# EAGLE design PlusCartUnified_X7 (EAGLE 7.7.0)
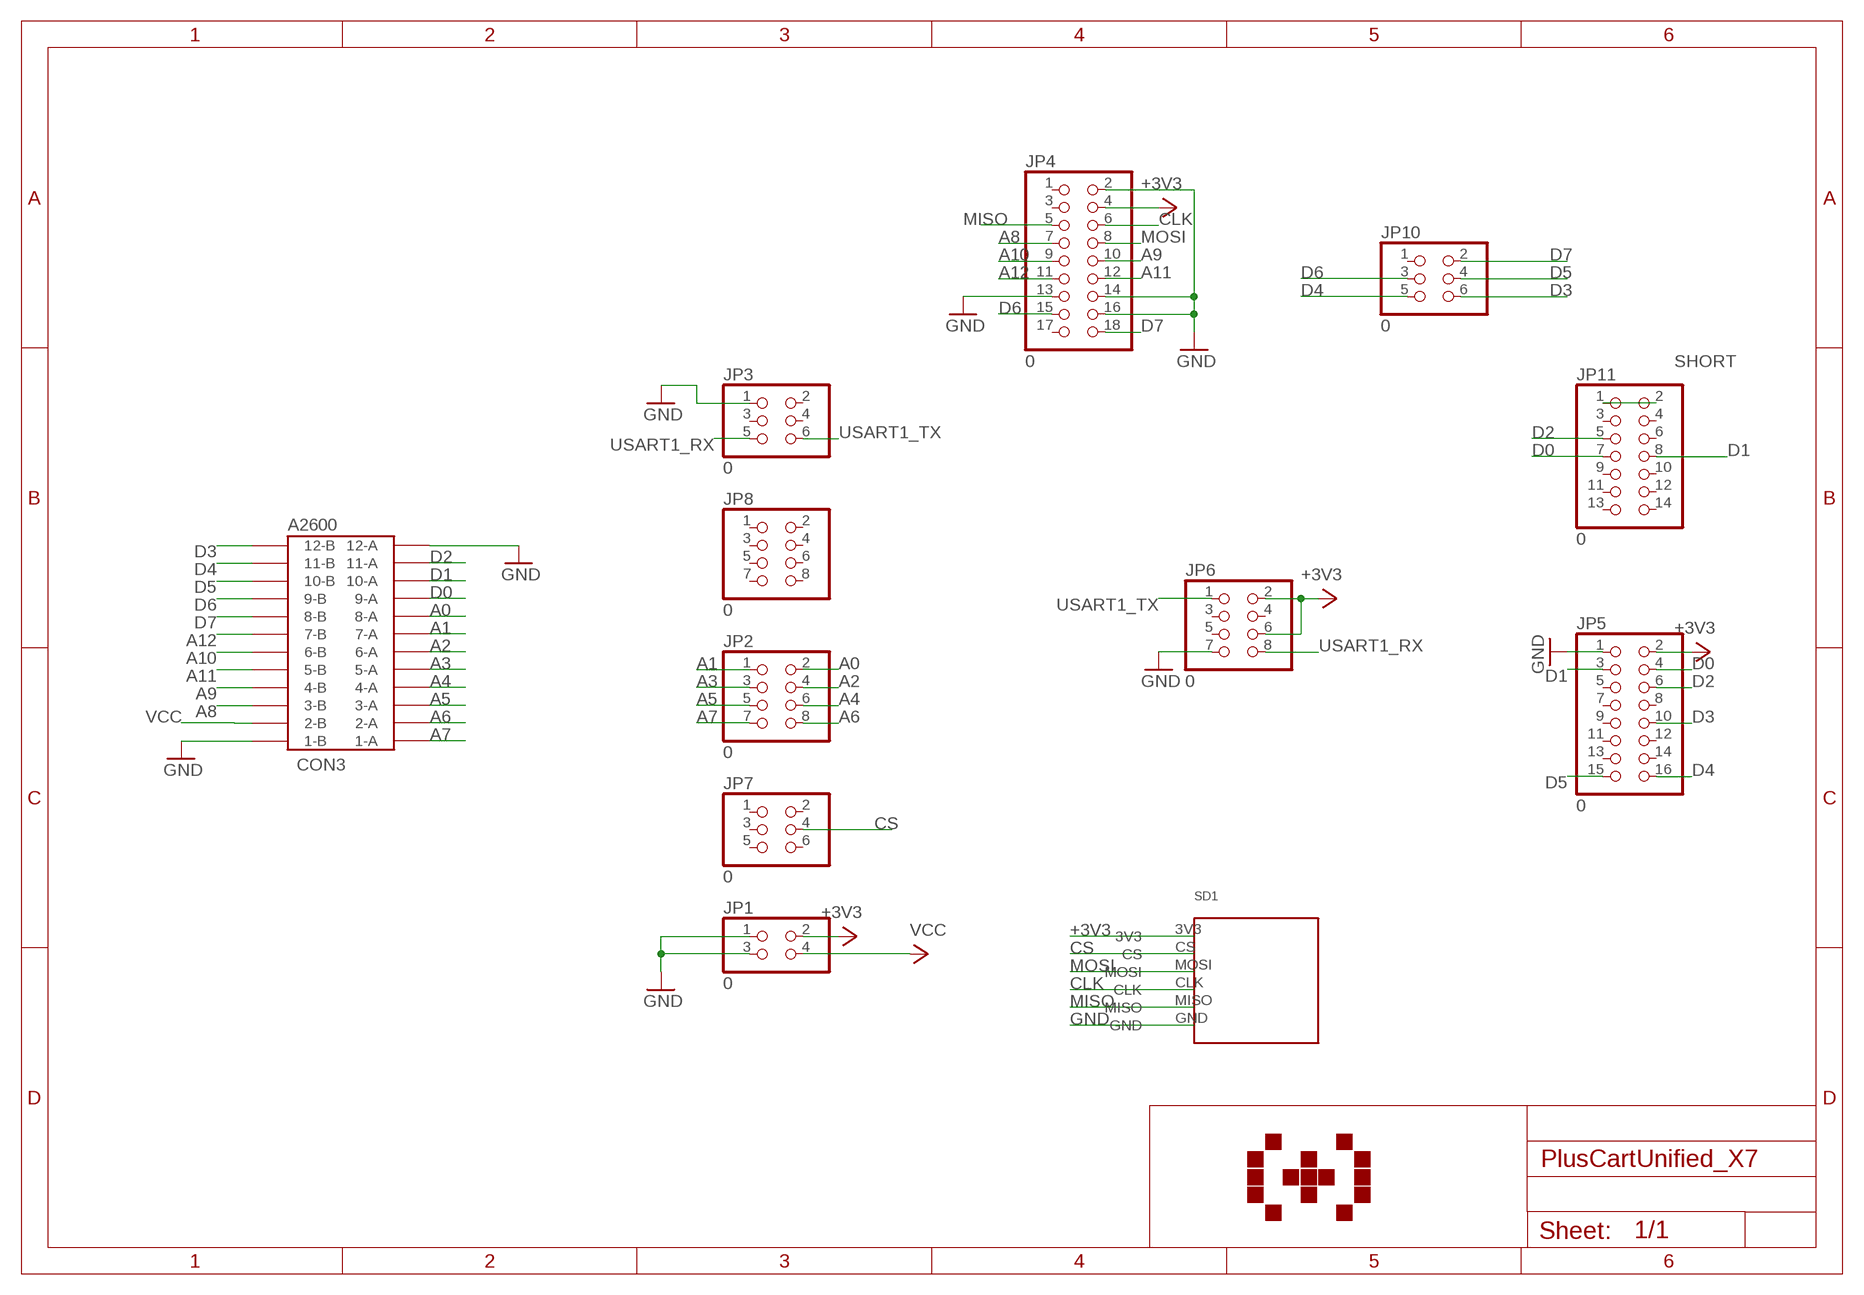
[diagram p0: schematic, sheet 1]

## Parts
CON3  A2600  24PINEDGE-254MM  [24PINEDGE-254MM]
JP1  0  PINHD-2X2  [2X02]
JP2  0  PINHD-2X4  [2X04]
JP3  0  PINHD-2X3  [2X03]
JP4  0  PINHD-2X9  [2X09]
JP5  0  PINHD-2X8  [2X08]
JP6  0  PINHD-2X4  [2X04]
JP7  0  PINHD-2X3  [2X03]
JP8  0  PINHD-2X4  [2X04]
JP10  0  PINHD-2X3  [2X03]
JP11  0  PINHD-2X7  [2X07]
SD1  MICROSDMICROSD2  [MICROSD_FOOTPRINT]

## Nets
+3V3: JP1.2 JP4.4 JP5.2 JP6.2 JP6.6 SD1.3V3
A0: CON3.8-A JP2.2
A1: CON3.7-A JP2.1
A2: CON3.6-A JP2.4
A3: CON3.5-A JP2.3
A4: CON3.4-A JP2.6
A5: CON3.3-A JP2.5
A6: CON3.2-A JP2.8
A7: CON3.1-A JP2.7
A8: CON3.3-B JP4.7
A9: CON3.4-B JP4.10
A10: CON3.6-B JP4.9
A11: CON3.5-B JP4.12
A12: CON3.7-B JP4.11
CLK: JP4.6 SD1.CLK
CS: JP7.4 SD1.CS
D0: CON3.9-A JP5.4 JP11.7
D1: CON3.10-A JP5.3 JP11.8
D2: CON3.11-A JP5.6 JP11.5
D3: CON3.12-B JP5.10 JP10.6
D4: CON3.11-B JP5.16 JP10.5
D5: CON3.10-B JP5.15 JP10.4
D6: CON3.9-B JP4.15 JP10.3
D7: CON3.8-B JP4.18 JP10.2
GND: CON3.1-B CON3.12-A JP1.1 JP1.3 JP3.1 JP4.2 JP4.13 JP4.14 JP4.16 JP5.1 JP6.7 SD1.GND
MISO: JP4.5 SD1.MISO
MOSI: JP4.8 SD1.MOSI
SHORT: JP11.1 JP11.2
USART1_RX: JP3.5 JP6.8
USART1_TX: JP3.6 JP6.1
VCC: CON3.2-B JP1.4
Unconnected: JP3.2 JP3.3 JP3.4 JP4.1 JP4.3 JP4.17 JP5.5 JP5.7 JP5.8 JP5.9 JP5.11 JP5.12 JP5.13 JP5.14 JP6.3 JP6.4 JP6.5 JP7.1 JP7.2 JP7.3 JP7.5 JP7.6 JP8.1 JP8.2 JP8.3 JP8.4 JP8.5 JP8.6 JP8.7 JP8.8 JP10.1 JP11.3 JP11.4 JP11.6 JP11.9 JP11.10 JP11.11 JP11.12 JP11.13 JP11.14

## Library data of the parts
CON3 = con-edge:24PINEDGE-254MM: 24 PIN EDGE CONNECTOR 2.54mm ATARI 2600 CARTRIDGE PORT
JP1 = pinhead:PINHD-2X2: PIN HEADER
JP2 JP6 = pinhead:PINHD-2X4: PIN HEADER
JP3 = pinhead:PINHD-2X3: PIN HEADER
JP4 = pinhead:PINHD-2X9: PIN HEADER
JP5 = pinhead:PINHD-2X8: PIN HEADER
JP7 JP10 = pinhead@1:PINHD-2X3: PIN HEADER
JP8 = pinhead@1:PINHD-2X4: PIN HEADER
JP11 = pinhead@1:PINHD-2X7: PIN HEADER
SD1 = MICROSD:MICROSD

## Board
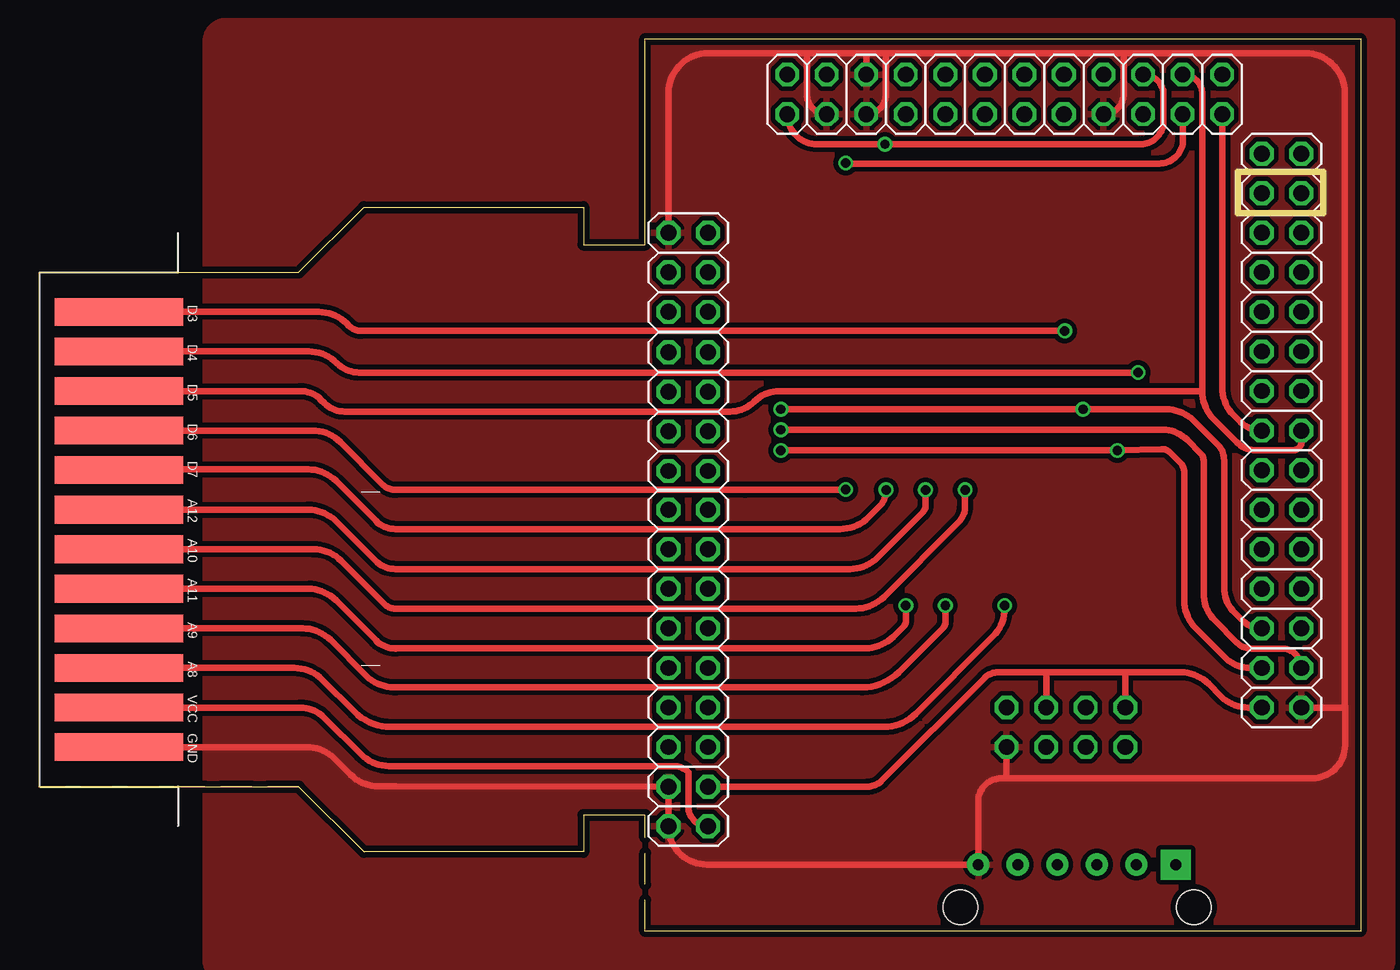
[diagram p1: board, top side]
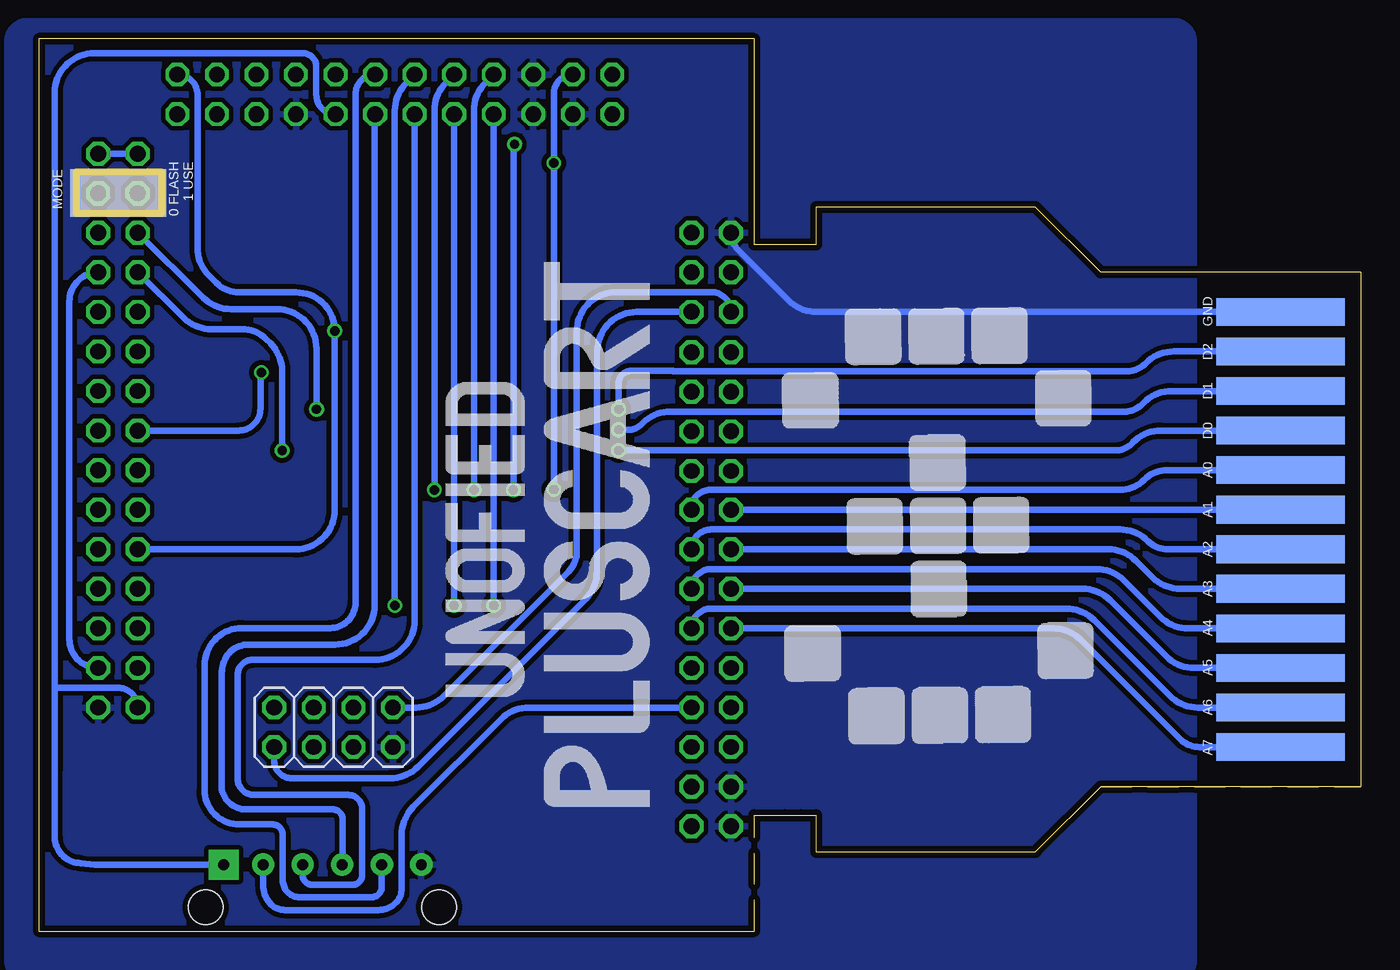
[diagram p2: board, bottom side, seen from below]

Size 84.89 x 57.28 mm. Coordinates in mm from the lower left corner, seen from the top.
Outline: 38.94,7.44 34.98,7.44
Outline: 34.98,7.44 34.98,5.08 20.88,5.08 16.69,9.27
Outline: 0,9.27 0,42.29 16.69,42.29 20.88,46.48 34.98,46.48 34.98,44.07 38.94,44.07 38.94,57.28 84.89,57.28 84.89,0 38.94,0 38.94,7.44
Outline: 0,9.27 16.69,9.27
Outline: 38.94,7.44 34.98,7.44
Outline: 16.69,9.27 0,9.27
Copper layers (1*16): Top 0.0356mm / dielectric 1.5011mm / Bottom 0.0356mm
Design rules "OSHPark2layer": minimum track width 6mil, minimum drill 13mil, track to track 6mil, track to pad 6mil, pad to pad 6mil, via to via 6mil, smd to smd 6mil, copper to edge 15mil, drill to drill 6mil, minimum pad ring 7mil, minimum via ring 7mil, stop-mask expansion 3mil, vias tented up to drill 0mil, thermal gap 10mil
Milling: 4 lines

### Footprints (pad centres in the part's own frame; a part is rotated, then mirrored left to right if it is on the bottom)
24PINEDGE-254MM = smd 1.778 x 8.255: 1-A -22.86,-7.62; 2-A -20.32,-7.62; 3-A -17.78,-7.62; 4-A -15.24,-7.62; 5-A -12.7,-7.62; 6-A -10.16,-7.62; 7-A -7.62,-7.62; 8-A -5.08,-7.62; 9-A -2.54,-7.62; 10-A 0,-7.62; 11-A 2.54,-7.62; 12-A 5.08,-7.62 | smd 1.778 x 8.255 bottom: 1-B -22.86,-7.62; 2-B -20.32,-7.62; 3-B -17.78,-7.62; 4-B -15.24,-7.62; 5-B -12.7,-7.62; 6-B -10.16,-7.62; 7-B -7.62,-7.62; 8-B -5.08,-7.62; 9-B -2.54,-7.62; 10-B 0,-7.62; 11-B 2.54,-7.62; 12-B 5.08,-7.62
2X02 = drill 1.016 octagon: 1 -1.27,-1.27; 2 -1.27,1.27; 3 1.27,-1.27; 4 1.27,1.27
2X04 = drill 1.016 octagon: 1 -3.81,-1.27; 2 -3.81,1.27; 3 -1.27,-1.27; 4 -1.27,1.27; 5 1.27,-1.27; 6 1.27,1.27; 7 3.81,-1.27; 8 3.81,1.27
2X03 = drill 1.016 octagon: 1 -2.54,-1.27; 2 -2.54,1.27; 3 0,-1.27; 4 0,1.27; 5 2.54,-1.27; 6 2.54,1.27
2X09 = drill 1.016 octagon: 1 -10.16,-1.27; 2 -10.16,1.27; 3 -7.62,-1.27; 4 -7.62,1.27; 5 -5.08,-1.27; 6 -5.08,1.27; 7 -2.54,-1.27; 8 -2.54,1.27; 9 0,-1.27; 10 0,1.27; 11 2.54,-1.27; 12 2.54,1.27; 13 5.08,-1.27; 14 5.08,1.27; 15 7.62,-1.27; 16 7.62,1.27; 17 10.16,-1.27; 18 10.16,1.27
2X08 = drill 1.016 octagon: 1 -8.89,-1.27; 2 -8.89,1.27; 3 -6.35,-1.27; 4 -6.35,1.27; 5 -3.81,-1.27; 6 -3.81,1.27; 7 -1.27,-1.27; 8 -1.27,1.27; 9 1.27,-1.27; 10 1.27,1.27; 11 3.81,-1.27; 12 3.81,1.27; 13 6.35,-1.27; 14 6.35,1.27; 15 8.89,-1.27; 16 8.89,1.27
2X07 = drill 1.016 octagon: 1 -7.62,-1.27; 2 -7.62,1.27; 3 -5.08,-1.27; 4 -5.08,1.27; 5 -2.54,-1.27; 6 -2.54,1.27; 7 0,-1.27; 8 0,1.27; 9 2.54,-1.27; 10 2.54,1.27; 11 5.08,-1.27; 12 5.08,1.27; 13 7.62,-1.27; 14 7.62,1.27
MICROSD_FOOTPRINT = drill 0.7 pad 1.93 square: 3V3 -15.24,6.35 | drill 0.7 pad 1.422: CLK -15.24,-1.27; CS -15.24,3.81; GND -15.24,-6.35; MISO -15.24,-3.81; MOSI -15.24,1.27 | hole 2.2: -12.5,7.5; -12.5,-7.5

### Placement (x,y rotation side)
CON3  12.75,34.67 90 bottom
JP1  41.71,8 270 top
JP2  41.71,23.24 270 top
JP3  41.71,42.29 270 top
JP4  58.22,53.72 180 top
JP5  79.81,23.24 90 top
JP6  65.96,13.08 0 bottom
JP7  41.71,14.35 270 top
JP8  41.71,33.35 270 top
JP10  73.46,53.72 0 top
JP11  79.81,42.29 270 top
SD1  66.68,-10.97 270 top

### Tracks (layer width: path | path; a pad name or v marks a point on that pad's centre or on a via)
+3V3
  Top 0.406: JP1.2 53.22,9.27 arc45 54.12,9.64 60.71,16.24 arc-45 61.61,16.61 64.78,16.61 | JP5.2 77.67,14.35 arc-45 75.92,15.07 75.13,15.87 arc45 73.33,16.61 69.84,16.61 | 64.78,16.61 69.84,16.61 | JP6.6 64.69,16.39 arc-45 64.78,16.61 | JP6.2 69.77,16.44 arc-45 69.84,16.61
  Bottom 0.406: JP4.4 arc90 67.07,53.68 67.07,55.5 arc-90 67.94,56.37 81.33,56.37 arc-90 83.87,53.83 83.87,15.62 | 83.87,15.62 83.87,10.37 arc90 83.86,10.36 83.86,6.02 arc-90 82.21,4.37 81.3,4.27 SD1.3V3 | JP5.2 arc-90 79.81,15.62 83.87,15.62
A0
  Bottom 0.406: JP2.2 42.98,27.12 arc90 41.77,28.33 15.47,28.33 arc-45 13.89,28.98 arc45 12.42,29.59 CON3.8-A
A1
  Bottom 0.406: JP2.1 CON3.7-A
A2
  Bottom 0.406: JP2.4 arc90 41.71,25.78 15.45,25.78 arc45 13.66,25.04 arc-45 12.39,24.51 CON3.6-A
A3
  Bottom 0.406: JP2.3 16.22,24.51 arc45 14.42,23.77 13.37,22.71 arc-45 11.57,21.97 CON3.5-A
A4
  Bottom 0.406: JP2.6 arc90 41.71,23.24 16.98,23.24 arc45 15.18,22.5 12.86,20.18 arc-45 11.06,19.43 CON3.4-A
A5
  Bottom 0.406: JP2.5 17.87,21.97 arc45 16.07,21.23 12.48,17.64 arc-45 10.68,16.89 CON3.3-A
A6
  Bottom 0.406: JP2.8 arc90 41.71,20.7 18.91,20.7 arc45 17.11,19.96 12.25,15.1 arc-45 10.45,14.35 CON3.2-A
A7
  Bottom 0.406: JP2.7 19.75,19.43 arc45 17.95,18.69 11.58,12.32 arc-45 10.36,11.81 CON3.1-A
A8  (via drill 0.6)
  Top 0.406: CON3.3-B 16.4,16.89 arc-45 18.19,16.15 20.26,14.08 arc45 22.6,13.11 54.28,13.11 arc45 56.32,13.95 61.28,18.92 arc45 62.03,20.71 v62.03,20.9
  Bottom 0.406: JP4.7 61.28,54.47 arc-45 62.03,52.67 v62.03,20.9
A9  (via drill 0.6)
  Top 0.406: v58.22,20.9 58.22,19.84 arc-45 58.05,19.45 55.23,16.62 arc-45 52.89,15.65 22.91,15.65 22.82,15.65 arc-45 21.02,16.39 18.73,18.69 arc45 16.93,19.43 CON3.4-B
  Bottom 0.406: JP4.10 v58.22,20.9
A10  (via drill 0.6)
  Top 0.406: v59.49,28.32 59.49,27.28 arc-45 59.06,26.24 54.26,21.45 arc-45 52.47,20.7 22.91,20.7 arc-45 22.17,21.01 19.41,23.77 arc45 17.62,24.51 CON3.6-B
  Bottom 0.406: JP4.9 58.74,54.47 arc-45 59.49,52.67 v59.49,28.32
A11  (via drill 0.6)
  Top 0.406: v55.68,20.9 55.68,19.89 arc-45 55.55,19.59 54.87,18.91 arc-45 53.07,18.16 22.97,18.16 arc45 22.91,18.14 arc-45 21.65,18.66 19.08,21.23 arc45 17.29,21.97 CON3.5-B
  Bottom 0.406: JP4.12 v55.68,20.9
A12  (via drill 0.6)
  Top 0.406: v56.95,28.32 56.95,27.33 arc-45 56.75,26.85 53.88,23.98 arc-45 52.08,23.24 22.91,23.24 arc-45 21.61,23.78 19.08,26.31 arc45 17.29,27.05 CON3.7-B
  Bottom 0.406: JP4.11 56.2,54.47 arc-45 56.95,52.67 v56.95,28.32
CLK
  Bottom 0.406: JP4.6 arc-45 63.32,52.4 63.32,20.93 arc90 65.86,18.39 71.42,18.39 arc-90 73.11,16.71 arc-90 73.16,16.65 73.16,9.39 arc-90 71.59,7.81 66.01,7.81 arc90 65.38,7.18 65.38,4.29 arc90 SD1.CLK
CS
  Bottom 0.406: JP7.4 53.41,14.35 arc-45 55.21,13.61 60.85,7.97 arc-45 61.59,6.17 61.59,2.72 arc45 61.97,1.81 arc45 63.08,1.35 69.11,1.35 arc45 69.97,1.7 arc45 70.48,2.95 SD1.CS
D0  (via drill 0.6)
  Top 0.406: JP5.4 77.76,16.89 arc-45 76.23,17.53 74.3,19.45 arc-45 73.56,21.25 73.56,29.47 arc45 73.31,30.07 72.64,30.73 arc45 72.13,30.95 v69.27,30.85 v47.65,30.85
  Bottom 0.406: v47.65,30.85 15.77,30.85 arc-45 14.71,31.29 14.61,31.39 arc45 12.82,32.13 CON3.9-A | JP11.7 75.58,39.38 arc-45 73.79,38.63 71.81,38.63 arc45 70.28,38 70.01,37.73 arc45 69.27,35.93 v69.27,30.85
D1  (via drill 0.6)
  Top 0.406: JP5.3 arc90 79.83,18.14 77.9,18.14 arc-45 76.9,18.55 75.55,19.91 arc-45 74.8,21.7 74.8,30.23 arc45 74.62,30.66 73.75,31.54 arc45 72.19,32.18 v47.65,32.18
  Bottom 0.406: JP5.3 arc90 82.93,18.74 82.93,40.41 arc90 JP11.8 | CON3.10-A 12.13,34.67 arc-45 13.93,33.93 14.02,33.83 arc45 15.19,33.35 44.31,33.35 arc-45 46.11,32.61 46.18,32.54 arc45 47.04,32.18 v47.65,32.18
D2  (via drill 0.6)
  Top 0.406: v47.65,33.5 v67.06,33.5 72.38,33.5 arc-45 74.18,32.76 75.72,31.22 arc-45 76.12,30.23 76.12,22.08 arc45 76.81,20.42 77.28,19.95 arc45 JP5.6
  Bottom 0.406: JP11.5 74.34,40.67 arc-45 72.54,39.93 69.6,39.93 arc90 67.06,37.39 v67.06,33.5 | v47.65,33.5 47.65,35.18 arc90 46.86,35.97 44.18,35.97 arc90 44.16,35.94 14.97,35.94 arc-45 13.87,36.4 13.8,36.47 arc45 12,37.21 CON3.11-A
D3  (via drill 0.6)
  Top 0.406: v65.89,38.53 20.67,38.53 arc-45 19.94,38.84 19.77,39.01 arc45 17.97,39.75 CON3.12-B
  Bottom 0.406: JP5.10 68.42,24.51 arc-90 65.88,27.05 65.88,38.51 arc-45 v65.89,38.53 arc-90 68.36,41.01 72.03,41.01 arc45 73.49,41.61 73.96,42.08 arc45 74.7,43.88 74.7,53.66 arc-90 JP10.6
D4  (via drill 0.6)
  Top 0.406: JP5.16 arc-45 77.15,32.71 76.74,33.11 arc-45 76,34.91 76,35.93 arc45 76.02,35.98 JP10.5 | v70.6,35.86 20.58,35.86 arc-45 19.15,36.45 19.13,36.47 arc45 17.34,37.21 CON3.11-B
  Bottom 0.406: JP5.16 72.07,32.13 arc-90 70.66,33.54 70.66,35.8 arc90 v70.6,35.86
D5
  Top 0.406: JP10.4 arc-90 74.73,53.74 74.73,34.69 arc-90 74.71,34.67 | 74.71,34.67 74.71,34.66 arc45 75.46,32.87 76.95,31.38 arc45 78.16,30.88 80.55,30.88 arc90 81.1,31.43 81.1,32.11 arc90 JP5.15 | 74.71,34.67 47.58,34.67 arc45 45.92,33.99 arc-45 44.39,33.35 19.63,33.35 arc-45 18.34,33.88 18.11,34.11 arc45 16.76,34.67 CON3.10-B
D6  (via drill 0.6)
  Top 0.406: v51.82,28.35 45.39,28.35 45.36,28.32 22.91,28.32 arc-45 22.09,28.66 19.36,31.39 arc45 17.57,32.13 CON3.9-B | JP10.3 73.48,50.81 arc-90 71.95,49.28 51.86,49.28 arc-90 v51.82,49.32
  Bottom 0.406: v51.82,28.35 v51.82,49.32 51.82,53.77 arc90 JP4.15
D7  (via drill 0.6)
  Top 0.406: v54.41,28.32 arc-45 53.96,27.24 53.29,26.57 arc-45 51.45,25.81 22.91,25.81 arc-45 21.65,26.33 19.08,28.9 arc45 17.29,29.64 5.25,29.64 arc45 CON3.8-B | JP4.18 arc90 49.99,50.52 v54.34,50.52 70.76,50.52 arc90 72.23,51.99 72.23,53.7 arc90 JP10.2
  Bottom 0.406: v54.41,28.32 54.41,50.45 arc-90 v54.34,50.52
GND
  Top 0.406: 83.87,14.45 83.87,53.82 arc90 81.33,56.36 69.68,56.36 | 69.68,56.36 54.41,56.36 | 54.41,56.36 53.19,56.36 | JP4.2 arc90 69.68,53.75 69.68,56.36 | JP3.1 40.44,53.82 arc-90 42.98,56.36 49.33,56.36 | 49.33,56.36 53.19,56.36 | JP4.13 53.14,56.3 arc-90 53.19,56.36 | JP4.16 arc-90 49.33,53.72 49.33,56.36 | JP4.14 arc90 54.41,53.72 54.41,56.36 | CON3.1-B 17.18,11.81 arc-45 18.98,11.07 20.01,10.04 arc45 21.8,9.3 22.91,9.3 JP1.1 JP1.3 arc90 42.9,4.27 SD1.GND 60.32,8.31 arc-90 61.83,9.81 62.18,9.81 | JP6.7 62.15,9.84 arc90 62.18,9.81 | 83.87,14.45 arc-90 83.89,14.42 83.89,11.93 arc-90 81.77,9.81 62.18,9.81 | JP5.1 83.77,14.35 arc90 83.87,14.45
  Bottom 0.406: JP3.1 arc-45 39.99,43.75 36.74,40.5 arc-45 34.94,39.75 CON3.12-A
  pour Top (isolate 0.305): 10.72,-1.91 10.72,57.15 arc-90 11.99,58.42 86.92,58.42 86.92,-1.91 arc-90 85.65,-3.17 11.99,-3.17 arc-90
  pour Bottom (isolate 0.305): 10.72,57.15 10.72,-1.91 arc90 11.99,-3.17 85.65,-3.17 arc90 86.92,-1.91 86.92,57.15 arc90 85.65,58.42 11.99,58.42 arc90
MISO
  Bottom 0.406: JP4.5 arc-90 64.55,53.74 64.55,21.09 arc90 66.19,19.45 71.84,19.45 arc-90 74.24,17.05 74.24,9 arc-45 73.63,7.54 73.59,7.49 arc-45 72.04,6.85 69.89,6.85 arc90 69.22,6.18 69.22,3.25 arc-90 68.14,2.17 63.53,2.17 arc-90 62.86,2.85 SD1.MISO arc-90 SD1.MISO
MOSI
  Bottom 0.406: JP4.8 60.76,19.95 arc90 63.3,17.41 71.17,17.41 arc-90 72.12,16.46 72.12,9.79 arc-90 71.07,8.74 65.03,8.74 arc90 64.12,7.83 64.12,5.73 | 64.12,5.73 64.12,3.59 arc90 64.73,2.98 67.34,2.98 arc90 67.94,3.58 SD1.MOSI | 64.12,5.73
SHORT
  Bottom 0.406: JP11.1 JP11.2
USART1_RX
  Bottom 0.406: JP3.5 arc-90 41.71,41.02 47.8,41.02 arc-90 50.34,38.48 50.34,24.38 arc45 50.88,23.08 58.87,15.1 arc45 60.67,14.35 JP6.8
USART1_TX
  Bottom 0.406: JP3.6 46.49,39.75 arc-90 49.03,37.21 49.03,24.23 arc45 49.05,24.19 49.05,23.09 arc45 49.79,21.29 60.53,10.56 arc45 62.32,9.81 68.65,9.81 arc90 69.77,10.94 JP6.1
VCC
  Top 0.406: JP1.4 arc-90 41.71,8 arc45 41.71,8 41.71,10.2 arc45 40.77,10.59 22.91,10.59 22.49,10.59 arc-45 20.69,11.34 18.32,13.7 arc45 16.76,14.35 CON3.2-B

### Text on the board
tNames: D3 | D4 | D5 | D6 | D7 | A12 | A10 | A11 | A9 | A8 | VCC | GND
bNames: 0 FLASH / 1 USE | MODE | GND | D2 | D1 | D0 | A0 | A1 | A2 | A3 | A4 | A5 | A6 | A7